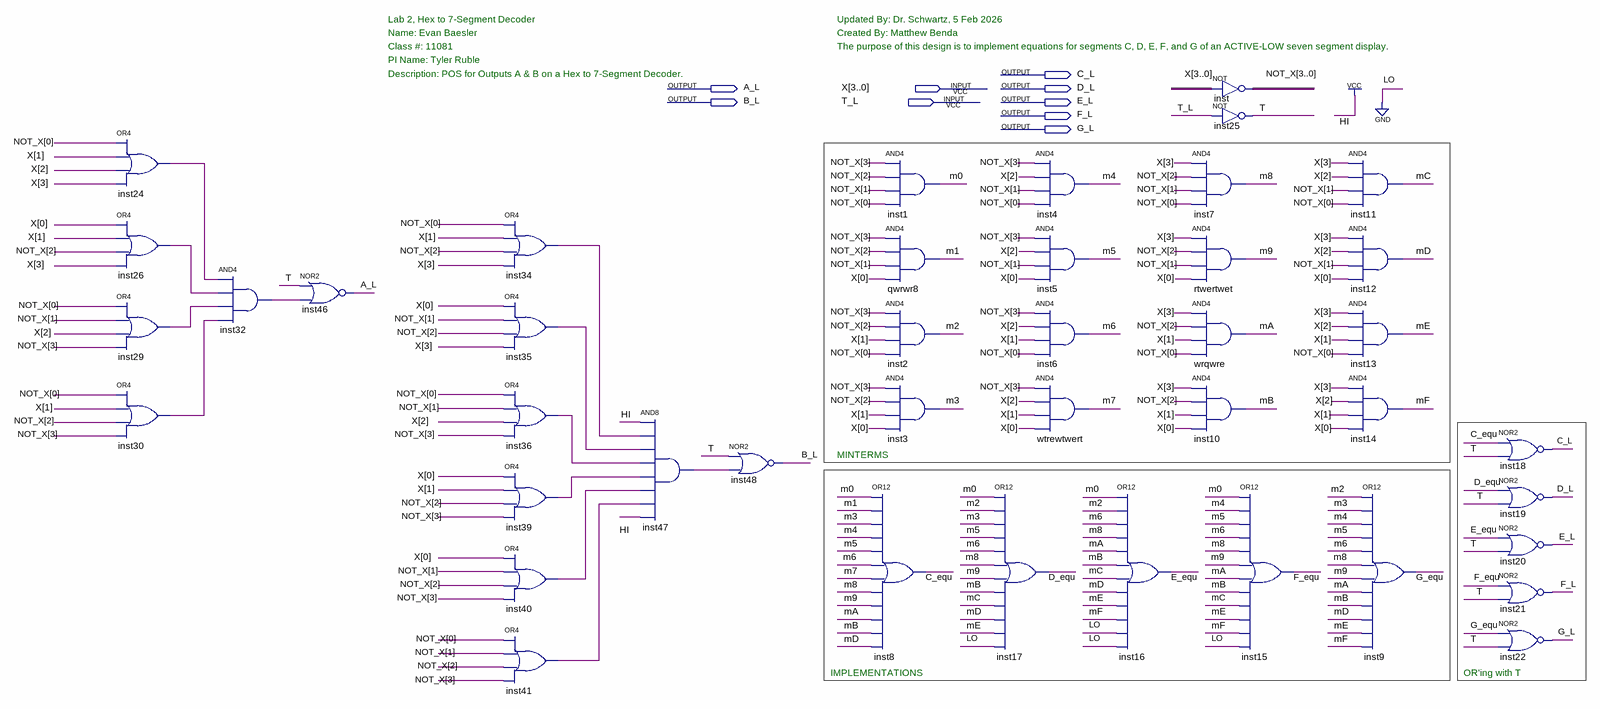
[diagram p0: schematic sheet]
// Quartus schematic lab2_decoder.bdf as structural Verilog: 42 symbols, 9 pins
module lab2_decoder (
  input  [3:0] X,
  input  T_L,
  output C_L,
  output A_L,
  output D_L,
  output B_L,
  output E_L,
  output F_L,
  output G_L
);

  wire C_equ, D_equ, E_equ, F_equ, G_equ, inst24_out, inst26_out, inst29_out, inst30_out, inst32_out,
       inst34_out, inst35_out, inst36_out, inst39_out, inst40_out, inst41_out, inst47_out, m0, m1, m2, m3,
       m4, m5, m6, m7, m8, m9, mA, mB, mC, mD, mE, mF, T;
  wire [3:0] NOT_X;

  or inst24 (inst24_out, NOT_X[0], X[1], X[2], X[3]);
  or inst26 (inst26_out, X[0], X[1], NOT_X[2], X[3]);
  or inst29 (inst29_out, NOT_X[0], NOT_X[1], X[2], NOT_X[3]);
  or inst30 (inst30_out, NOT_X[0], X[1], NOT_X[2], NOT_X[3]);
  and inst32 (inst32_out, inst24_out, inst26_out, inst29_out, inst30_out);
  nor inst46 (A_L, T, inst32_out);
  or inst34 (inst34_out, NOT_X[0], X[1], NOT_X[2], X[3]);
  or inst35 (inst35_out, X[0], NOT_X[1], NOT_X[2], X[3]);
  or inst36 (inst36_out, NOT_X[0], NOT_X[1], X[2], NOT_X[3]);
  or inst39 (inst39_out, X[0], X[1], NOT_X[2], NOT_X[3]);
  or inst40 (inst40_out, X[0], NOT_X[1], NOT_X[2], NOT_X[3]);
  or inst41 (inst41_out, NOT_X[0], NOT_X[1], NOT_X[2], NOT_X[3]);
  and inst47 (inst47_out, 1'b1, inst34_out, inst35_out, inst36_out, inst39_out, inst40_out, inst41_out, 1'b1);
  nor inst48 (B_L, T, inst47_out);
  or inst8 (C_equ, m0, m1, m3, m4, m5, m6, m7, m8, m9, mA, mB, mD);
  and inst1 (m0, NOT_X[3], NOT_X[2], NOT_X[1], NOT_X[0]);
  and qwrwr8 (m1, NOT_X[3], NOT_X[2], NOT_X[1], X[0]);
  and inst2 (m2, NOT_X[3], NOT_X[2], X[1], NOT_X[0]);
  and inst3 (m3, NOT_X[3], NOT_X[2], X[1], X[0]);
  and inst4 (m4, NOT_X[3], X[2], NOT_X[1], NOT_X[0]);
  and inst5 (m5, NOT_X[3], X[2], NOT_X[1], X[0]);
  and inst6 (m6, NOT_X[3], X[2], X[1], NOT_X[0]);
  and wtrewtwert (m7, NOT_X[3], X[2], X[1], X[0]);
  or inst17 (D_equ, m0, m2, m3, m5, m6, m8, m9, mB, mC, mD, mE, 1'b0);
  or inst16 (E_equ, m0, m2, m6, m8, mA, mB, mC, mD, mE, mF, 1'b0, 1'b0);
  and inst7 (m8, X[3], NOT_X[2], NOT_X[1], NOT_X[0]);
  and rtwertwet (m9, X[3], NOT_X[2], NOT_X[1], X[0]);
  and wrqwre (mA, X[3], NOT_X[2], X[1], NOT_X[0]);
  and inst10 (mB, X[3], NOT_X[2], X[1], X[0]);
  assign NOT_X = ~X;  // NOT inst, 4 bits wide
  not inst25 (T, T_L);
  or inst15 (F_equ, m0, m4, m5, m6, m8, m9, mA, mB, mC, mE, mF, 1'b0);
  and inst11 (mC, X[3], X[2], NOT_X[1], NOT_X[0]);
  and inst12 (mD, X[3], X[2], NOT_X[1], X[0]);
  and inst13 (mE, X[3], X[2], X[1], NOT_X[0]);
  and inst14 (mF, X[3], X[2], X[1], X[0]);
  or inst9 (G_equ, m2, m3, m4, m5, m6, m8, m9, mA, mB, mD, mE, mF);
  nor inst18 (C_L, C_equ, T);
  nor inst19 (D_L, D_equ, T);
  nor inst20 (E_L, E_equ, T);
  nor inst21 (F_L, F_equ, T);
  nor inst22 (G_L, G_equ, T);

  // Notes on the sheet:
  //   Lab 2, Hex to 7-Segment Decoder
  //   Updated By: Dr. Schwartz, 5 Feb 2026
  //   Name: Evan Baesler
  //   Created By: Matthew Benda
  //   Class #: 11081
  //   The purpose of this design is to implement equations for segments C, D, E, F, and G of an ACTIVE-LOW seven segment display.            
  //   PI Name: Tyler Ruble
  //   Description: POS for Outputs A & B on a Hex to 7-Segment Decoder.
  //   MINTERMS
  //   IMPLEMENTATIONS
  //   OR'ing with T
endmodule
